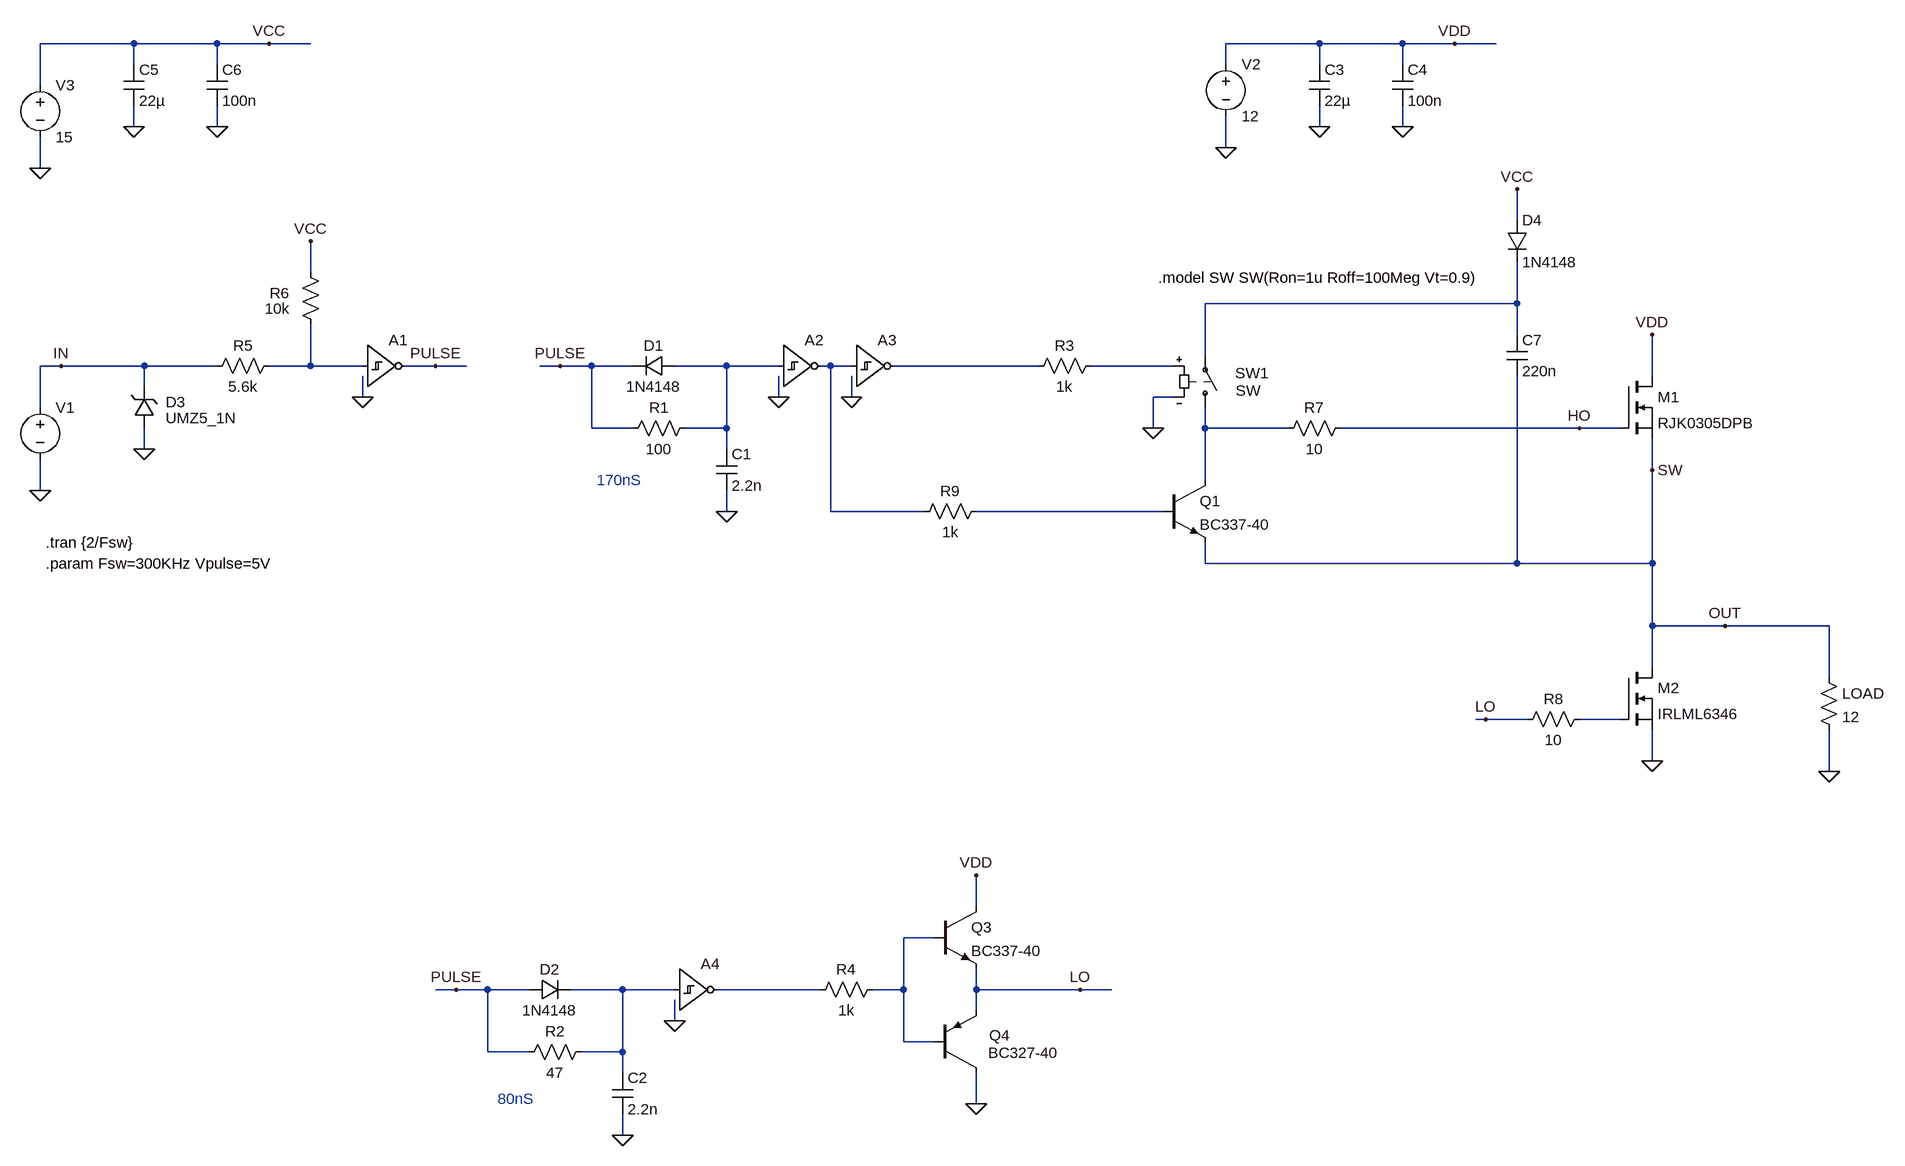
[diagram p0: schematic v1.1.asc]
v1.1.asc, the LTspice schematic file:
Version 4.1
SHEET 1 2676 1204
WIRE -400 -496 -544 -496
WIRE -272 -496 -400 -496
WIRE -192 -496 -272 -496
WIRE -128 -496 -192 -496
WIRE 1424 -496 1280 -496
WIRE 1552 -496 1424 -496
WIRE 1632 -496 1552 -496
WIRE 1696 -496 1632 -496
WIRE -400 -464 -400 -496
WIRE -272 -464 -272 -496
WIRE 1280 -464 1280 -496
WIRE 1424 -464 1424 -496
WIRE 1552 -464 1552 -496
WIRE -544 -432 -544 -496
WIRE -400 -368 -400 -400
WIRE -272 -368 -272 -400
WIRE 1424 -368 1424 -400
WIRE 1552 -368 1552 -400
WIRE 1280 -336 1280 -384
WIRE -544 -304 -544 -352
WIRE 1728 -224 1728 -272
WIRE -128 -144 -128 -192
WIRE 1728 -96 1728 -160
WIRE 1728 -96 1248 -96
WIRE 1728 -48 1728 -96
WIRE 1248 -16 1248 -96
WIRE -512 0 -544 0
WIRE -384 0 -512 0
WIRE -272 0 -384 0
WIRE -128 0 -128 -64
WIRE -128 0 -192 0
WIRE -48 0 -128 0
WIRE 64 0 16 0
WIRE 112 0 64 0
WIRE 256 0 224 0
WIRE 304 0 256 0
WIRE 368 0 304 0
WIRE 512 0 432 0
WIRE 592 0 512 0
WIRE 672 0 656 0
WIRE 704 0 672 0
WIRE 992 0 768 0
WIRE 1200 0 1072 0
WIRE 1936 16 1936 -48
WIRE -384 32 -384 0
WIRE -48 48 -48 16
WIRE 592 48 592 16
WIRE 704 48 704 16
WIRE 1200 48 1168 48
WIRE -544 64 -544 0
WIRE 304 96 304 0
WIRE 368 96 304 96
WIRE 512 96 512 0
WIRE 512 96 448 96
WIRE 1168 96 1168 48
WIRE 1248 96 1248 64
WIRE 1376 96 1248 96
WIRE 1824 96 1456 96
WIRE 1888 96 1824 96
WIRE -384 128 -384 96
WIRE 512 128 512 96
WIRE 1936 160 1936 112
WIRE 1248 176 1248 96
WIRE -544 192 -544 144
WIRE 512 224 512 192
WIRE 672 224 672 0
WIRE 816 224 672 224
WIRE 1184 224 896 224
WIRE 1248 304 1248 272
WIRE 1728 304 1728 16
WIRE 1728 304 1248 304
WIRE 1936 304 1936 160
WIRE 1936 304 1728 304
WIRE 1936 400 1936 304
WIRE 2048 400 1936 400
WIRE 2208 400 2048 400
WIRE 1936 464 1936 400
WIRE 2208 480 2208 400
WIRE 1680 544 1664 544
WIRE 1744 544 1680 544
WIRE 1888 544 1824 544
WIRE 1936 608 1936 560
WIRE 2208 624 2208 560
WIRE 896 832 896 784
WIRE 832 880 784 880
WIRE 96 960 64 960
WIRE 144 960 96 960
WIRE 208 960 144 960
WIRE 352 960 272 960
WIRE 432 960 352 960
WIRE 656 960 496 960
WIRE 784 960 784 880
WIRE 784 960 736 960
WIRE 896 960 896 928
WIRE 1056 960 896 960
WIRE 1104 960 1056 960
WIRE 896 992 896 960
WIRE 432 1008 432 976
WIRE 784 1040 784 960
WIRE 832 1040 784 1040
WIRE 144 1056 144 960
WIRE 208 1056 144 1056
WIRE 352 1056 352 960
WIRE 352 1056 288 1056
WIRE 352 1088 352 1056
WIRE 896 1136 896 1088
WIRE 352 1184 352 1152
FLAG -544 192 0
FLAG -512 0 IN
FLAG 592 48 0
FLAG 1824 96 HO
FLAG 512 224 0
FLAG 256 0 PULSE
FLAG 1056 960 LO
FLAG 352 1184 0
FLAG 96 960 PULSE
FLAG 432 1008 0
FLAG -48 48 0
FLAG 1280 -336 0
FLAG 1632 -496 VDD
FLAG 1424 -368 0
FLAG 1552 -368 0
FLAG 896 784 VDD
FLAG 896 1136 0
FLAG -128 -192 VCC
FLAG -384 128 0
FLAG 64 0 PULSE
FLAG -544 -304 0
FLAG -192 -496 VCC
FLAG -400 -368 0
FLAG -272 -368 0
FLAG 704 48 0
FLAG 1936 -48 VDD
FLAG 1936 608 0
FLAG 2048 400 OUT
FLAG 1680 544 LO
FLAG 1936 160 SW
FLAG 2208 624 0
FLAG 1728 -272 VCC
FLAG 1168 96 0
SYMBOL voltage -544 48 R0
WINDOW 3 41 64 Invisible 2
WINDOW 123 0 0 Left 0
WINDOW 39 0 0 Left 0
SYMATTR Value PULSE(0 {Vpulse} 0 {0.01/Fsw} {0.01/Fsw} {0.5/Fsw} {1/Fsw})
SYMATTR InstName V1
SYMBOL diode 432 -16 R90
WINDOW 0 0 32 VBottom 2
WINDOW 3 32 32 VTop 2
SYMATTR InstName D1
SYMATTR Value 1N4148
SYMBOL res 464 80 R90
WINDOW 0 0 56 VBottom 2
WINDOW 3 32 56 VTop 2
SYMATTR InstName R1
SYMATTR Value 100
SYMBOL cap 496 128 R0
SYMATTR InstName C1
SYMATTR Value 2.2n
SYMBOL diode 208 976 R270
WINDOW 0 32 32 VTop 2
WINDOW 3 0 32 VBottom 2
SYMATTR InstName D2
SYMATTR Value 1N4148
SYMBOL res 304 1040 R90
WINDOW 0 0 56 VBottom 2
WINDOW 3 32 56 VTop 2
SYMATTR InstName R2
SYMATTR Value 47
SYMBOL cap 336 1088 R0
SYMATTR InstName C2
SYMATTR Value 2.2n
SYMBOL res 1088 -16 R90
WINDOW 0 0 56 VBottom 2
WINDOW 3 32 56 VTop 2
SYMATTR InstName R3
SYMATTR Value 1k
SYMBOL voltage 1280 -480 R0
WINDOW 123 0 0 Left 0
WINDOW 39 0 0 Left 0
SYMATTR InstName V2
SYMATTR Value 12
SYMBOL cap 1408 -464 R0
SYMATTR InstName C3
SYMATTR Value 22µ
SYMBOL cap 1536 -464 R0
SYMATTR InstName C4
SYMATTR Value 100n
SYMBOL npn 832 832 R0
SYMATTR InstName Q3
SYMATTR Value BC337-40
SYMBOL pnp 832 1088 M180
WINDOW 0 84 58 Left 2
WINDOW 3 82 31 Left 2
SYMATTR InstName Q4
SYMATTR Value BC327-40
SYMBOL res 752 944 R90
WINDOW 0 0 56 VBottom 2
WINDOW 3 32 56 VTop 2
SYMATTR InstName R4
SYMATTR Value 1k
SYMBOL Digital\\schmtinv -48 -64 R0
WINDOW 3 8 104 Invisible 2
SYMATTR Value Vhigh=15
SYMATTR InstName A1
SYMBOL Digital\\schmtinv 592 -64 R0
WINDOW 3 8 104 Invisible 2
SYMATTR Value Vhigh=15
SYMATTR InstName A2
SYMBOL Digital\\schmtinv 704 -64 R0
WINDOW 3 8 104 Invisible 2
SYMATTR Value Vhigh=15
SYMATTR InstName A3
SYMBOL Digital\\schmtinv 432 896 R0
WINDOW 3 8 104 Invisible 2
SYMATTR Value Vhigh=15
SYMATTR InstName A4
SYMBOL res -176 -16 R90
WINDOW 0 0 56 VBottom 2
WINDOW 3 32 56 VTop 2
SYMATTR InstName R5
SYMATTR Value 5.6k
SYMBOL res -112 -48 R180
WINDOW 0 48 64 Left 2
WINDOW 3 48 40 Left 2
SYMATTR InstName R6
SYMATTR Value 10k
SYMBOL zener -400 96 M180
WINDOW 0 49 40 Left 2
WINDOW 3 49 16 Left 2
SYMATTR InstName D3
SYMATTR Value UMZ5_1N
SYMBOL voltage -544 -448 R0
WINDOW 123 0 0 Left 0
WINDOW 39 0 0 Left 0
SYMATTR InstName V3
SYMATTR Value 15
SYMBOL cap -416 -464 R0
SYMATTR InstName C5
SYMATTR Value 22µ
SYMBOL cap -288 -464 R0
SYMATTR InstName C6
SYMATTR Value 100n
SYMBOL nmos 1888 16 R0
SYMATTR InstName M1
SYMATTR Value RJK0305DPB
SYMBOL nmos 1888 464 R0
SYMATTR InstName M2
SYMATTR Value IRLML6346
SYMBOL res 1360 112 R270
WINDOW 0 32 56 VTop 2
WINDOW 3 0 56 VBottom 2
SYMATTR InstName R7
SYMATTR Value 10
SYMBOL res 1728 560 R270
WINDOW 0 32 56 VTop 2
WINDOW 3 0 56 VBottom 2
SYMATTR InstName R8
SYMATTR Value 10
SYMBOL res 2192 464 R0
SYMATTR InstName LOAD
SYMATTR Value 12
SYMBOL diode 1712 -224 R0
SYMATTR InstName D4
SYMATTR Value 1N4148
SYMBOL cap 1712 -48 R0
SYMATTR InstName C7
SYMATTR Value 220n
SYMBOL sw 1248 80 M180
WINDOW 0 46 69 Left 2
WINDOW 3 47 42 Left 2
SYMATTR InstName SW1
SYMBOL npn 1184 176 R0
SYMATTR InstName Q1
SYMATTR Value BC337-40
SYMBOL res 912 208 R90
WINDOW 0 0 56 VBottom 2
WINDOW 3 32 56 VTop 2
SYMATTR InstName R9
SYMATTR Value 1k
TEXT -536 304 Left 2 !.param Fsw=300KHz Vpulse=5V
TEXT -536 272 Left 2 !.tran {2/Fsw}
TEXT 312 176 Left 2 ;170nS
TEXT 160 1128 Left 2 ;80nS
TEXT 1176 -136 Left 2 !.model SW SW(Ron=1u Roff=100Meg Vt=0.9)

The netlist it stands for:
* v1.1.asc
V1 IN 0 PULSE(0 {Vpulse} 0 {0.01/Fsw} {0.01/Fsw} {0.5/Fsw} {1/Fsw})
D1 N003 PULSE 1N4148
R1 N003 PULSE 100
C1 N003 0 2.2n
D2 PULSE N011 1N4148
R2 N011 PULSE 47
C2 N011 0 2.2n
R3 N006 N005 1k
V2 VDD 0 12
C3 VDD 0 22µ
C4 VDD 0 100n
Q3 VDD N010 LO 0 BC337-40
Q4 0 N010 LO 0 BC327-40
R4 N010 N012 1k
A1 N002 0 0 0 0 PULSE 0 0 SCHMITT Vhigh=15
A2 N003 0 0 0 0 N004 0 0 SCHMITT Vhigh=15
A3 N004 0 0 0 0 N005 0 0 SCHMITT Vhigh=15
A4 N011 0 0 0 0 N012 0 0 SCHMITT Vhigh=15
R5 N002 IN 5.6k
R6 N002 VCC 10k
D3 0 IN UMZ5_1N
V3 VCC 0 15
C5 VCC 0 22µ
C6 VCC 0 100n
M1 VDD HO SW SW RJK0305DPB
M2 SW N009 0 0 IRLML6346
R7 N007 HO 10
R8 LO N009 10
R§LOAD SW 0 12
D4 VCC N001 1N4148
C7 N001 SW 220n
SW1 N007 N001 N006 0 SW
Q1 N007 N008 SW 0 BC337-40
R9 N008 N004 1k
.model D D
.lib standard.dio
.model NPN NPN
.model PNP PNP
.lib standard.bjt
.model NMOS NMOS
.model PMOS PMOS
.lib standard.mos
.param Fsw=300KHz Vpulse=5V
.tran {2/Fsw}
* 170nS
* 80nS
.model SW SW(Ron=1u Roff=100Meg Vt=0.9)
.backanno
.end